# EAGLE design My_Project (EAGLE 7.7.0)
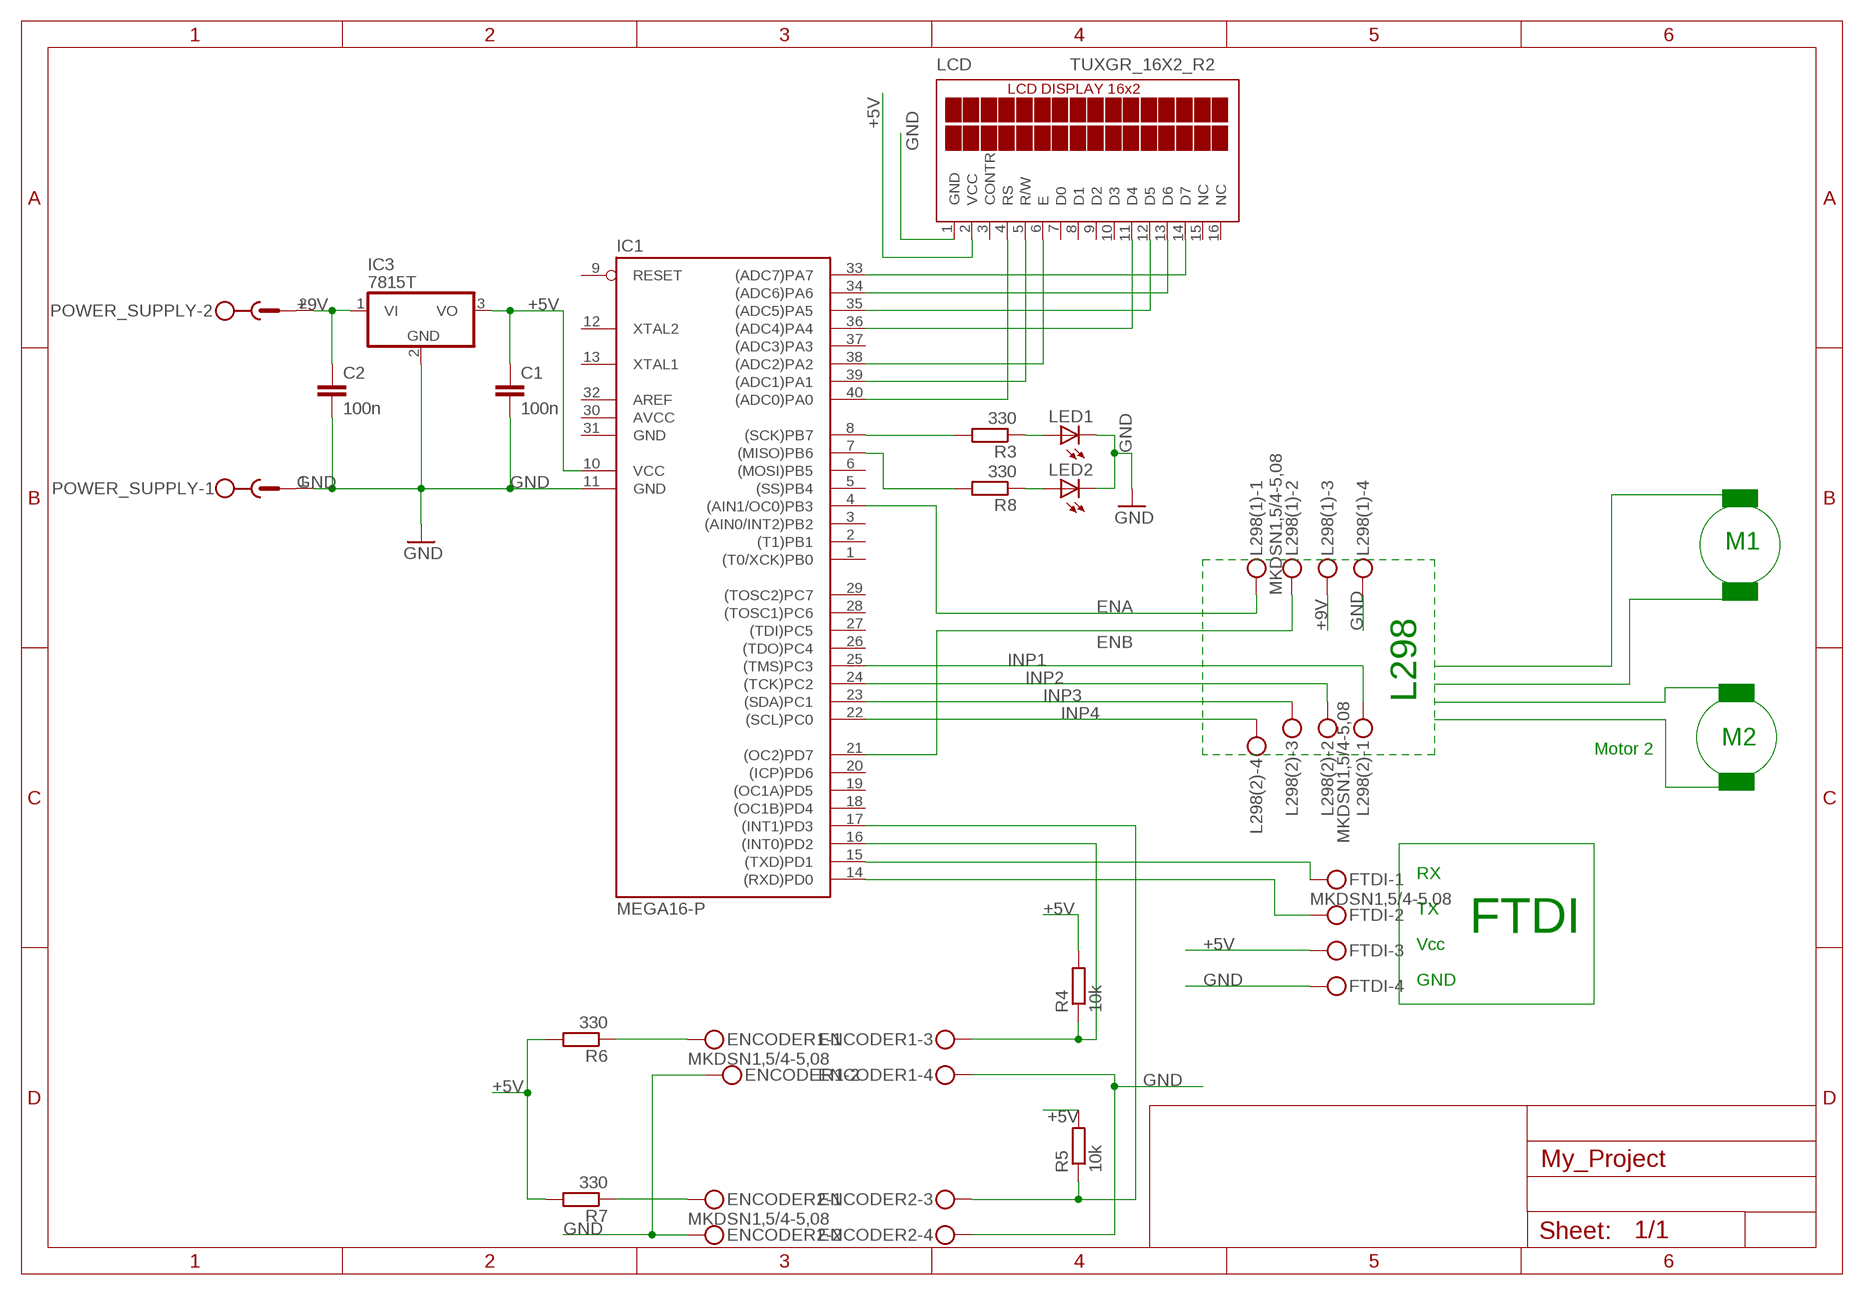
[diagram p0: schematic, sheet 1]

## Parts
C1  100n  C2,5-3  [C2.5-3]
C2  100n  C2,5-3  [C2.5-3]
ENCODER1  MKDSN1,5/4-5,08  [MKDSN1,5/4-5,08]
ENCODER2  MKDSN1,5/4-5,08  [MKDSN1,5/4-5,08]
FTDI  MKDSN1,5/4-5,08  [MKDSN1,5/4-5,08]
IC1  MEGA16-P  [DIL40]
IC3  7815T  [TO220H]
L298(1)  MKDSN1,5/4-5,08  [MKDSN1,5/4-5,08]
L298(2)  MKDSN1,5/4-5,08  [MKDSN1,5/4-5,08]
LCD  TUXGR_16X2_R2  [TUXGR_16X2_R2]
LED1  LEDLZR181  [LZR181]
LED2  LEDLZR181  [LZR181]
POWER_SUPPLY  MSTBV2  [MSTBV2]
R3  330  R-EU_0207/10  [0207/10]
R4  10k  R-EU_0207/10  [0207/10]
R5  10k  R-EU_0207/10  [0207/10]
R6  330  R-EU_0207/10  [0207/10]
R7  330  R-EU_0207/10  [0207/10]
R8  330  R-EU_0207/10  [0207/10]

## Nets
+5V: C1.1 FTDI.3 IC1.10(VCC) IC3.3(VO) LCD.2(VCC) R4.2 R5.2 R6.2 R7.2
+9V: C2.1 IC3.1(VI) L298(1).3 POWER_SUPPLY.2
ENA: IC1.4((AIN1/OC0)PB3) L298(1).1
ENB: IC1.21((OC2)PD7) L298(1).2
GND: C1.2 C2.2 ENCODER1.2 ENCODER1.4 ENCODER2.2 ENCODER2.4 FTDI.4 IC1.11(GND) IC3.2(GND) L298(1).4 LCD.1(GND) LED1.K(C) LED2.K(C) POWER_SUPPLY.1
INP1: IC1.25((TMS)PC3) L298(2).1
INP2: IC1.24((TCK)PC2) L298(2).2
INP3: IC1.23((SDA)PC1) L298(2).3
INP4: IC1.22((SCL)PC0) L298(2).4
LCD(D4): IC1.36((ADC4)PA4) LCD.11(D4)
LCD(D5): IC1.35((ADC5)PA5) LCD.12(D5)
LCD(D6): IC1.34((ADC6)PA6) LCD.13(D6)
LCD(D7): IC1.33((ADC7)PA7) LCD.14(D7)
LCD(E): IC1.38((ADC2)PA2) LCD.6(E)
LCD(RS): IC1.40((ADC0)PA0) LCD.4(RS)
LCD(RW): IC1.39((ADC1)PA1) LCD.5(R/W)
N$10: IC1.7((MISO)PB6) R8.2
N$16: IC1.8((SCK)PB7) R3.2
N$18: LED1.A R3.1
N$19: LED2.A R8.1
N$26: ENCODER1.1 R6.1
N$27: ENCODER1.3 IC1.16((INT0)PD2) R4.1
N$28: ENCODER2.3 IC1.17((INT1)PD3) R5.1
N$29: ENCODER2.1 R7.1
RX: FTDI.2 IC1.14((RXD)PD0)
TX: FTDI.1 IC1.15((TXD)PD1)
Unconnected: IC1.1((T0/XCK)PB0) IC1.2((T1)PB1) IC1.3((AIN0/INT2)PB2) IC1.5((SS)PB4) IC1.6((MOSI)PB5) IC1.9(RESET) IC1.12(XTAL2) IC1.13(XTAL1) IC1.18((OC1B)PD4) IC1.19((OC1A)PD5) IC1.20((ICP)PD6) IC1.26((TDO)PC4) IC1.27((TDI)PC5) IC1.28((TOSC1)PC6) IC1.29((TOSC2)PC7) IC1.32(AREF) IC1.37((ADC3)PA3) LCD.3(CONTR) LCD.7(D0) LCD.8(D1) LCD.9(D2) LCD.10(D3) LCD.15(NC) LCD.16(NC)

## Notes on the sheet
- M1
- L298
- M2
- Motor 2
- RX
- TX
- FTDI
- Vcc
- GND

## Power pins joined to a net without a drawn wire
AVCC: IC1.30(AVCC)
GND: IC1.31(GND)

## Library data of the parts
C1 C2 = capacitor-wima:C: CAPACITOR naming: grid - package width
ENCODER1 ENCODER2 FTDI L298(1) L298(2) = con-phoenix-508:MKDSN1,5/4-5,08: MKDSN 1,5/ 4-5,08 Printklemme Nennstrom: 13,5 A Nennspannung: 250 V Rastermaß: 5,08 mm Polzahl: 4 Anschlussart: Schraubanschluss Montage: Löten Anschlussrichtung Leiter/Platine: 0 ° Artikelnummer: 1729144 Source: http://eshop.phoenixcontact.com .. 1729144.pdf
IC1 = atmel:MEGA16-P: MICROCONTROLLER 16 Kbytes FLASH 1 kbytes SRAM 512 bytes EEPROM USART 8-channel 10 bit ADC Source: avr.lbr; MPN: ATMEGA16-16PU; OC_FARNELL: 9171142; OC_NEWARK: 01M6885
IC3 = linear:78*: Positive VOLTAGE REGULATOR Source: http://cache.national.com/ds/LM/LM78L05.pdf http://www.fairchildsemi.com/ds/LM/LM7805.pdf
LCD = display-lcd:TUXGR_16X2_R2: Tuxgraphics LCD display 16x2 characters reflective, without background light Source: tuxgr_12x2_r2.pdf; OC_FARNELL: unknown; OC_NEWARK: unknown
LED1 LED2 = led:LED: LED OSRAM: - CHIPLED LG R971, LG N971, LY N971, LG Q971, LY Q971, LO R971, LY R971 LH N974, LH R974 LS Q976, LO Q976, LY Q976 LO Q996 - Hyper CHIPLED LW Q18S LB Q993, LB Q99A, LB R99A - SideLED LS A670, LO A670, LY A670, LG A670, LP A670 LB A673, LV A673, LT A673, LW A673 LH A674 LY A675 LS A676, LA A676, LO A676, LY A676, LW A676 LS A679, LY A679, LG A679 - Hyper Micro SIDELED® LS Y876, LA Y876, LO Y876, LY Y876 LT Y87S - SmartLED LW L88C, LW L88S LB L89C, LB L89S, LG L890 LS L89K, LO L89K, LY L89K LS L896, LA L896, LO L896, LY L896 - TOPLED LS T670, LO T670, LY T670, LG T670, LP T670 LSG T670, LSP T670, LSY T670, LOP T670, LYG T670 LG T671, LOG T671, LSG T671 LB T673, LV T673, LT T673, LW T673 LH T674 LS T676, LA T676, LO T676, LY T676, LB T676, LH T676, LSB T676, LW T676 LB T67C, LV T67C, LT T67C, LS T67K, LO T67K, LY T67K, LW E67C LS E67B, LA E67B, LO E67B, LY E67B, LB E67C, LV E67C, LT E67C LW T67C LS T679, LY T679, LG T679 LS T770, LO T770, LY T770, LG T770, LP T770 LB T773, LV T773, LT T773, LW T773 LH T774 LS E675, LA E675, LY E675, LS T675 LS T776, LA T776, LO T776, LY T776, LB T776 LHGB T686 LT T68C, LB T68C - Hyper Mini TOPLED® LB M676 - Mini TOPLED Santana® LG M470 LS M47K, LO M47K, LY M47K Source: http://www.osram.convergy.de LUXEON: - LUMILED® LXK2-PW12-R00, LXK2-PW12-S00, LXK2-PW14-U00, LXK2-PW14-V00 LXK2-PM12-R00, LXK2-PM12-S00, LXK2-PM14-U00 LXK2-PE12-Q00, LXK2-PE12-R00, LXK2-PE12-S00, LXK2-PE14-T00, LXK2-PE14-U00 LXK2-PB12-K00, LXK2-PB12-L00, LXK2-PB12-M00, LXK2-PB14-N00, LXK2-PB14-P00, LXK2-PB14-Q00 LXK2-PR12-L00, LXK2-PR12-M00, LXK2-PR14-Q00, LXK2-PR14-R00 LXK2-PD12-Q00, LXK2-PD12-R00, LXK2-PD12-S00 LXK2-PH12-R00, LXK2-PH12-S00 LXK2-PL12-P00, LXK2-PL12-Q00, LXK2-PL12-R00 Source: www.luxeon.com KINGBRIGHT: KA-3528ASYC Source: www.kingbright.com
POWER_SUPPLY = con-phoenix-500:MSTBV2: PHOENIX; OC_FARNELL: unknown; OC_NEWARK: unknown
R3-R8 = resistor:R-EU_: RESISTOR, European symbol

## Board
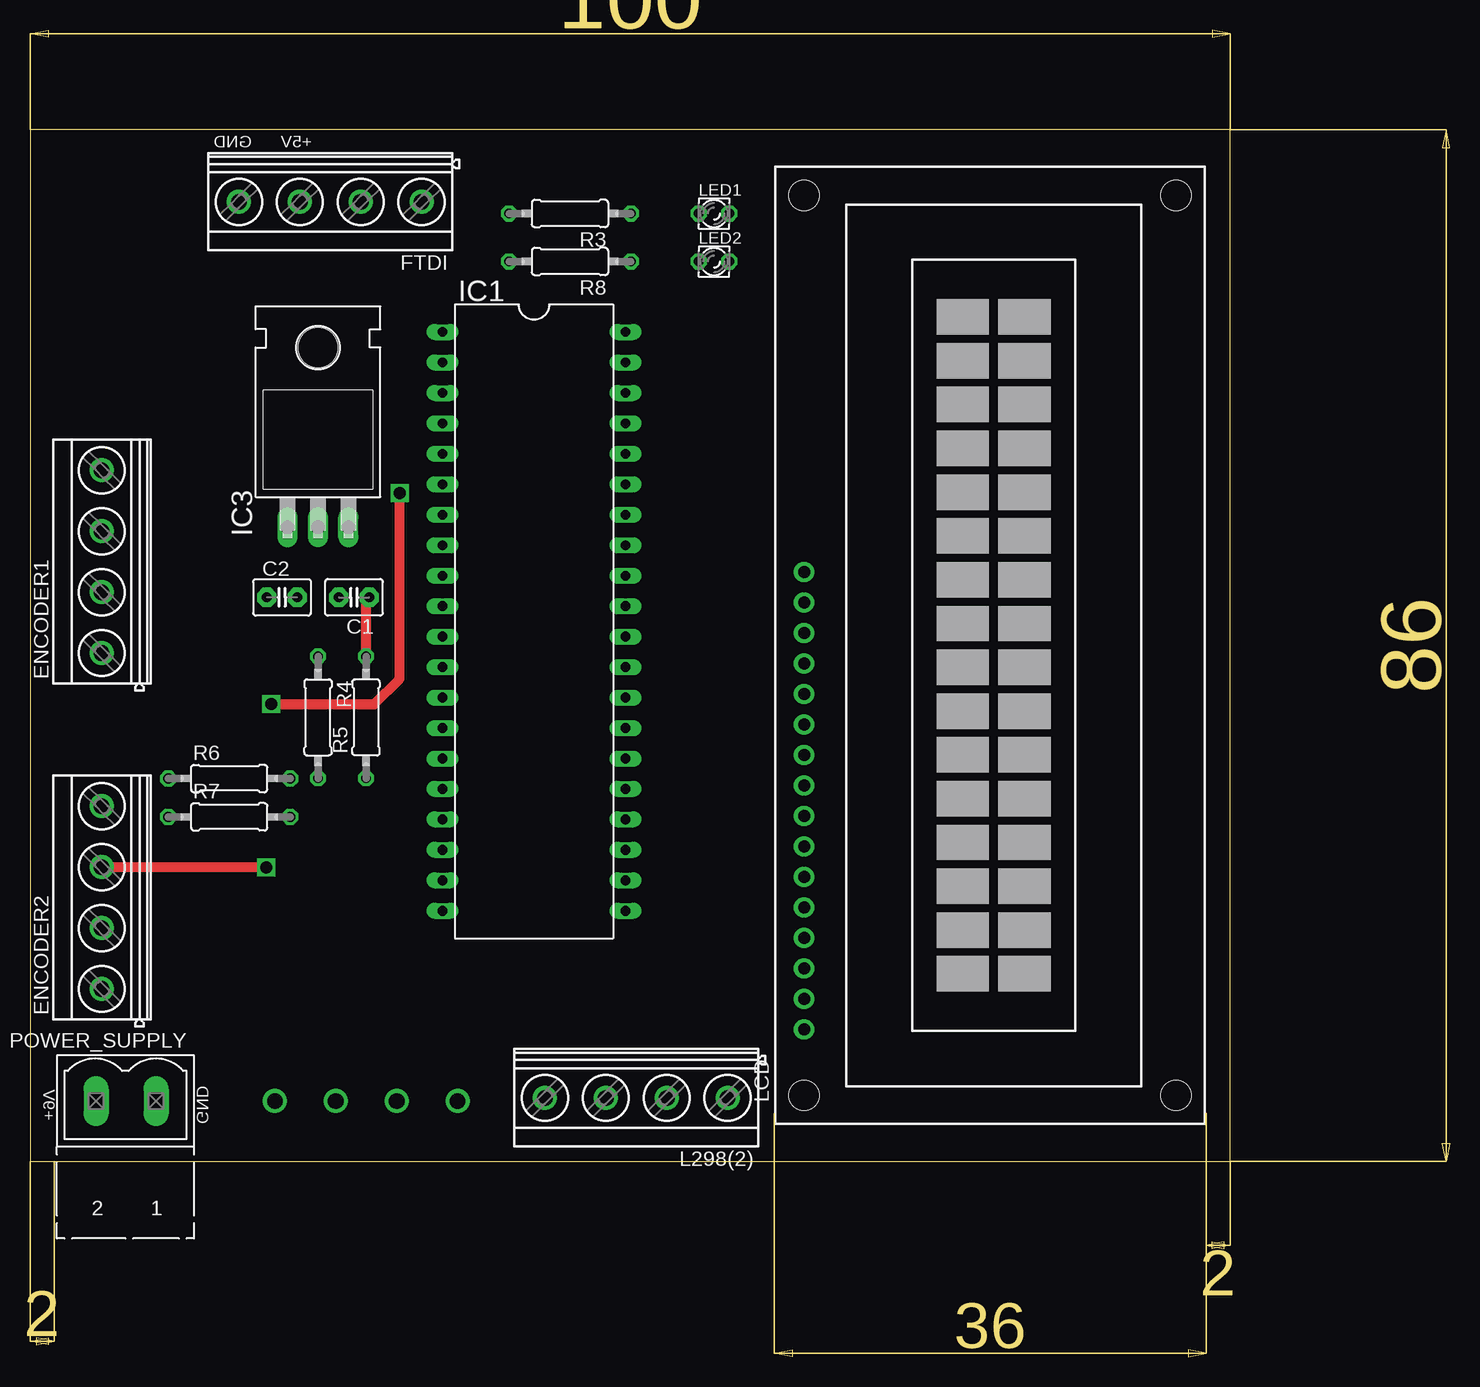
[diagram p1: board, top side]
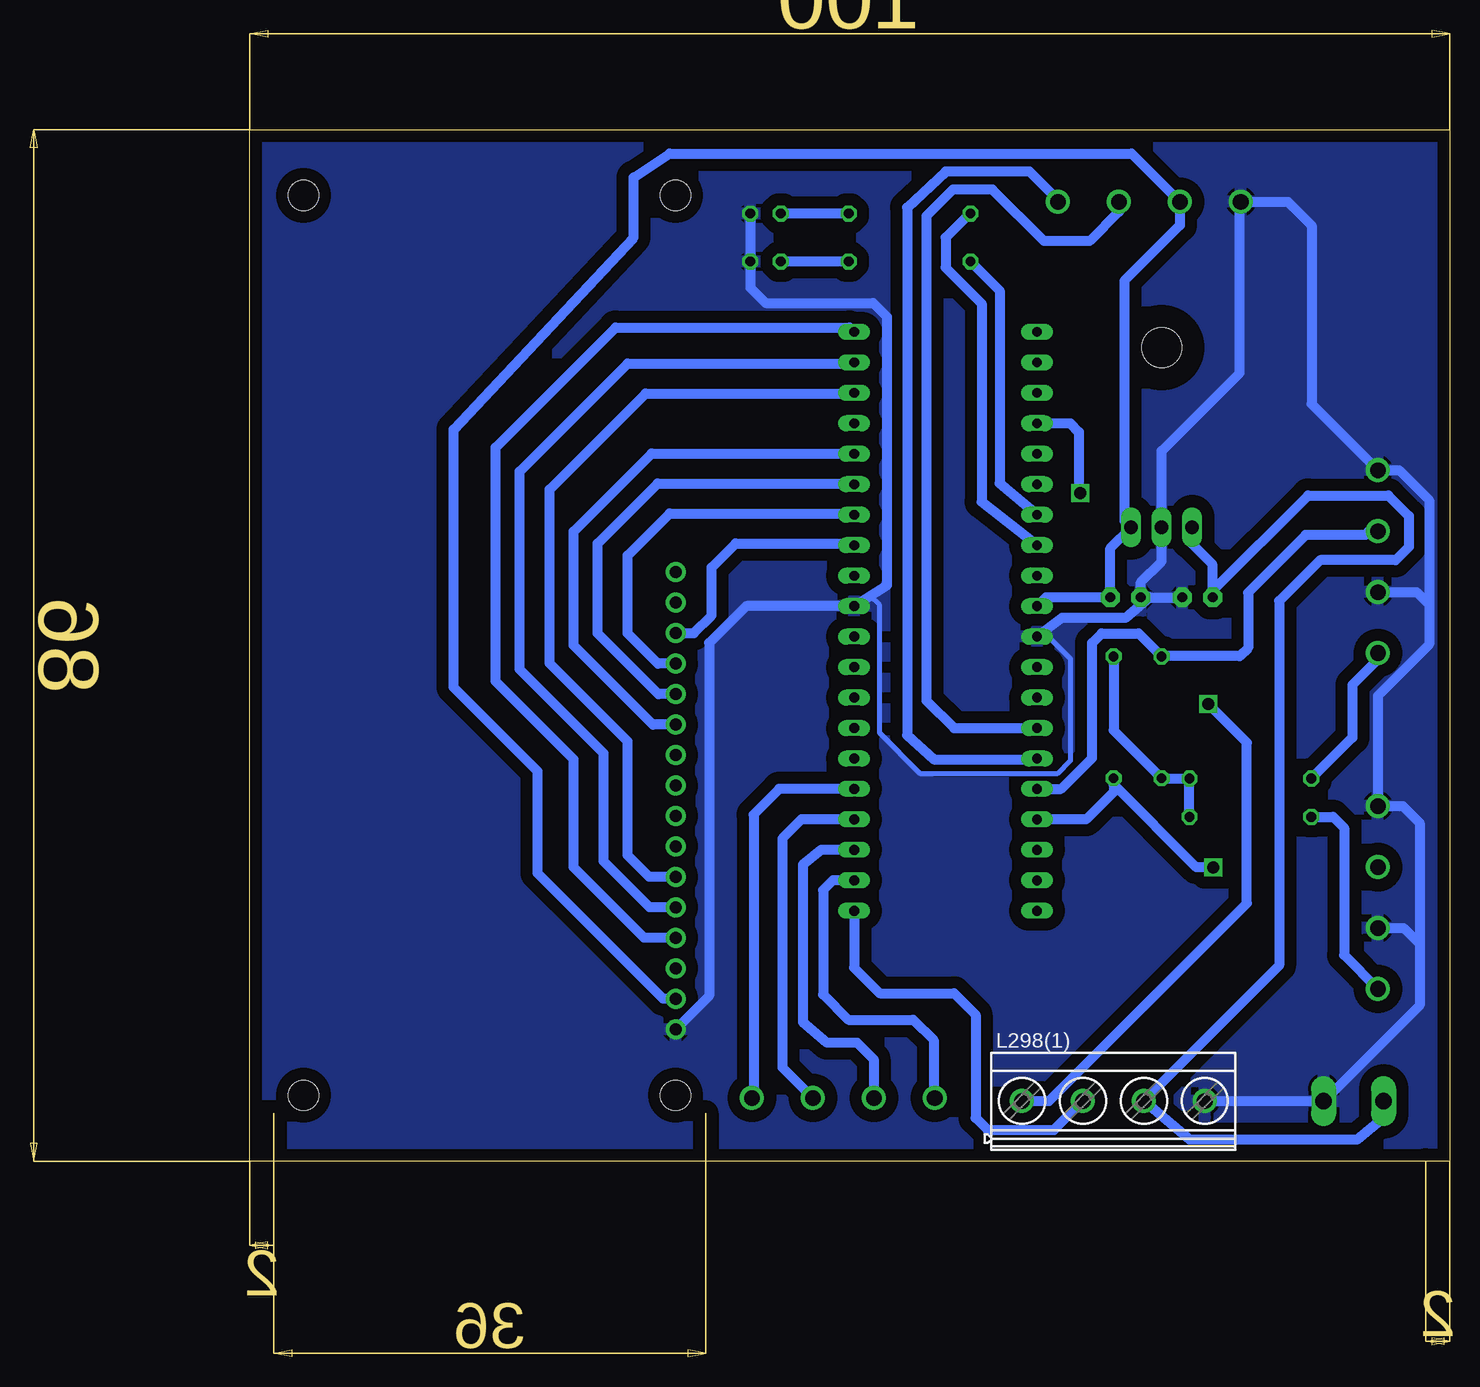
[diagram p2: board, bottom side, seen from below]

Size 100 x 86 mm. Coordinates in mm from the lower left corner, seen from the top.
Outline: 0,0 100,0 100,86 0,86 0,0
Copper layers (1*16): Top 0.035mm / dielectric 1.5mm / Bottom 0.035mm
Design rules "mws!": minimum track width 16mil, minimum drill 23mil, track to track 16mil, track to pad 16mil, pad to pad 16mil, via to via 16mil, smd to smd 8mil, copper to edge 40mil, drill to drill 8mil, minimum pad ring 10mil, minimum via ring 8mil, stop-mask expansion 4mil, vias tented up to drill 0mil, thermal gap 10mil

### Footprints (pad centres in the part's own frame; a part is rotated, then mirrored left to right if it is on the bottom)
C2.5-3 = drill 0.813 pad 1.6 octagon: 1 -1.27,0; 2 1.27,0
MKDSN1,5/4-5,08 = drill 1.3 pad 2: 1 -7.641,0.025; 2 -2.561,0.025; 3 2.519,0.025; 4 7.599,0.025
DIL40 = drill 0.813 long: 1 -24.13,-7.62; 2 -21.59,-7.62; 3 -19.05,-7.62; 4 -16.51,-7.62; 5 -13.97,-7.62; 6 -11.43,-7.62; 7 -8.89,-7.62; 8 -6.35,-7.62; 9 -3.81,-7.62; 10 -1.27,-7.62; 11 1.27,-7.62; 12 3.81,-7.62; 13 6.35,-7.62; 14 8.89,-7.62; 15 11.43,-7.62; 16 13.97,-7.62; 17 16.51,-7.62; 18 19.05,-7.62; 19 21.59,-7.62; 20 24.13,-7.62; 21 24.13,7.62; 22 21.59,7.62; 23 19.05,7.62; 24 16.51,7.62; 25 13.97,7.62; 26 11.43,7.62; 27 8.89,7.62; 28 6.35,7.62; 29 3.81,7.62; 30 1.27,7.62; 31 -1.27,7.62; 32 -3.81,7.62; 33 -6.35,7.62; 34 -8.89,7.62; 35 -11.43,7.62; 36 -13.97,7.62; 37 -16.51,7.62; 38 -19.05,7.62; 39 -21.59,7.62; 40 -24.13,7.62
TO220H = drill 1.118 long: 1 -2.54,-10.16; 2 0,-10.16; 3 2.54,-10.16 | hole 3.302: 0,4.826
TUXGR_16X2_R2 = drill 1 pad 1.676: 1 -32,15.5; 2 -29.46,15.5; 3 -26.92,15.5; 4 -24.38,15.5; 5 -21.84,15.5; 6 -19.3,15.5; 7 -16.76,15.5; 8 -14.22,15.5; 9 -11.68,15.5; 10 -9.14,15.5; 11 -6.6,15.5; 12 -4.06,15.5; 13 -1.52,15.5; 14 1.02,15.5; 15 3.56,15.5; 16 6.1,15.5 | hole 2.5: -37.5,-15.5; 37.5,-15.5; -37.5,15.5; 37.5,15.5
LZR181 = drill 0.813 octagon: A -1.27,0; K 1.27,0
MSTBV2 = drill 1.397 long: 1 -2.5,0; 2 2.5,0
0207/10 = drill 0.813 octagon: 1 -5.08,0; 2 5.08,0

### Placement (x,y rotation side)
C1  27,47 180 top
C2  21,47 0 top
ENCODER1  6,50 90 top
ENCODER2  6,22 90 top
FTDI  25,80 180 top
IC1  42,45 270 top
IC3  24,63 0 top
L298(1)  28,5 0 bottom
L298(2)  50.5,5.3 180 top
LCD  80,43 90 top
LED1  57,79 0 top
LED2  57,75 0 top
POWER_SUPPLY  8,5 180 top
R3  45,79 180 top
R4  24,37 270 top
R5  28,37 90 top
R6  16.6,31.9 0 top
R7  16.6,28.7 0 top
R8  45,75 180 top

### Tracks (layer width: path | path; a pad name or v marks a point on that pad's centre or on a via)
+5V
  Top 0.813: R5.2 28,46.73 C1.1
  Bottom 0.813: 34.51,46.4 IC1.10 33.65,47 C1.1 28.27,51.11 IC3.3 27.1,53.4 27.1,73.4 22.48,78.02 FTDI.3 26.51,84 65,84 68,82 68,77 83,61 83,39.5 76,32.5 76,24 65.54,13.54 LCD.2 | R5.2 28,35.92 R4.2 21.7,31.92 R6.2 R7.2
+9V
  Bottom 0.813: IC3.1 21.46,51.46 19.8,49.8 19.8,47.07 C2.1 19.73,47.57 11.8,55.5 5.1,55.5 3.4,53.8 3.4,51.2 4.5,50.1 10.8,50.1 14.2,46.7 14.2,16.31 L298(1).3 21.66,1.8 7.7,1.8 5.5,3.6 POWER_SUPPLY.2
ENA  (via drill 1 pad 1.27)
  Top 0.813: v20.1,38.1 28.7,38.1 30.8,40.2 v30.8,55.7
  Bottom 0.813: L298(1).1 33.38,5.03 16.9,21.5 16.9,34.9 v20.1,38.1 | IC1.4 31.61,61.51 30.9,60.8 30.9,55.8 v30.8,55.7
ENB
  Bottom 0.813: IC1.21 49.62,16.12 47.5,14 41.3,14 39.5,12.2 39.5,3.6 38.5,2.6 32.99,2.6 L298(1).2
GND
  Bottom 0.406: IC1.11 33.43,43.73 31.6,41.9 31.6,33.4 32.7,32.3 44.1,32.3 47.5,35.7 47.5,46.36 48.27,47.12
  Bottom 0.813: LED1.K LED2.K 58.27,72.82 57,71.55 48.05,71.55 46.9,70.4 46.9,47.99 48.27,47.12 IC1.31 58.63,46.27 61.7,43.2 61.7,13.8 LCD.1 | 25,47 C2.2 | 25,47 C1.2 25.73,48.27 24,50 IC3.2 24,59.2 17.5,65.7 17.5,79.88 FTDI.4 13.47,79.97 11.5,78 11.5,63.12 ENCODER1.4 4.2,57.6 1.7,55.1 1.7,46.4 | 25,47 27,45.3 32.31,45.3 IC1.11 | L298(1).4 20.38,5 POWER_SUPPLY.1 2.5,13 2.5,18.1 | 1.7,46.4 1.7,43.08 5.97,38.8 ENCODER2.4 3.9,29.6 2.5,28.2 2.5,18.1 | ENCODER1.2 2.74,47.44 1.7,46.4 | ENCODER2.2 3.84,19.44 2.5,18.1
  pour Bottom (isolate 1.016): -11.4,101 122.5,100.5 122.5,-21 -11,-19.5
INP1
  Bottom 0.813: IC1.25 55.87,31.03 58,28.9 58,5.42 L298(2).1
INP2
  Bottom 0.813: IC1.24 54.01,28.49 55.6,26.9 55.6,7.81 L298(2).2
INP3
  Bottom 0.813: IC1.23 52.35,25.95 53.9,24.7 53.9,11.6 51.9,9.9 49.4,9.9 48,8.5 48,5.29 L298(2).3
INP4
  Bottom 0.813: IC1.22 51.39,23.41 52.2,22.6 52.2,13.9 50.1,11.8 44.7,11.8 43,10.1 43,5.37 L298(2).4
LCD(D4)
  Bottom 0.813: LCD.11 66.4,36.4 73,43 73,52.5 66.5,59 49.65,59 IC1.36
LCD(D5)
  Bottom 0.813: LCD.12 65.94,38.94 71,44 71,51.5 66,56.5 49.69,56.5 IC1.35
LCD(D6)
  Bottom 0.813: LCD.13 65.98,41.48 68.5,44 68.5,50.5 65,54 49.73,54 IC1.34
LCD(D7)
  Bottom 0.813: LCD.14 62.98,44.02 61.5,45.5 61.5,49.5 59.5,51.5 49.77,51.5 IC1.33
LCD(E)
  Bottom 0.813: LCD.6 66.7,23.7 68.5,25.5 68.5,35 75,41.5 75,56 67,64 49.67,64 IC1.38
LCD(RS)
  Bottom 0.813: LCD.4 67.12,18.62 73,24.5 73,33.5 79.5,40 79.5,59.5 69.5,69.5 49.99,69.5 IC1.40
LCD(RW)
  Bottom 0.813: LCD.5 66.66,21.16 70.5,25 70.5,34 77.5,41 77.5,57.5 68.5,66.5 49.71,66.5 IC1.39
N$10
  Bottom 0.813: IC1.7 37.5,56.51 37.5,72.58 R8.2
N$16
  Bottom 0.813: R3.2 40,79 42,77 42,74.5 39,71.5 39,54.97 IC1.8
N$18
  Bottom 0.813: R3.1 LED1.A
N$19
  Bottom 0.813: R8.1 LED2.A
N$26
  Bottom 0.813: ENCODER1.1 5.97,41.83 8.1,39.7 8.1,35.32 R6.1
N$27
  Bottom 0.813: IC1.16 32.37,31.03 29.8,33.6 29.8,43.2 29,44 25.92,44 R4.1 23.98,42.1 17.5,42.1 16.8,42.8 16.8,47.4 12,52.2 7,52.2 6.68,52.52 ENCODER1.3
N$28  (via drill 1 pad 1.27)
  Top 0.813: ENCODER2.3 19.68,24.52 v19.7,24.5
  Bottom 0.813: R5.1 28,31.4 | 28,31.4 28,30.8 30.3,28.5 IC1.17 | v19.7,24.5 21.1,24.5 28,31.4
N$29
  Bottom 0.813: R7.1 9.7,28.7 8.8,27.8 8.8,17.18 ENCODER2.1
RX
  Bottom 0.813: FTDI.2 27.56,79.14 30,76.7 33.8,76.7 38.1,81 41.4,81 43.6,78.8 43.6,38.4 41.3,36.1 IC1.14
TX
  Bottom 0.813: FTDI.1 32.64,80.14 35,82.5 42,82.5 45.2,79.5 45.2,35.5 43,33.5 34.45,33.5 IC1.15

### Text on the board
tNames: GND | +5V | +9V | GND